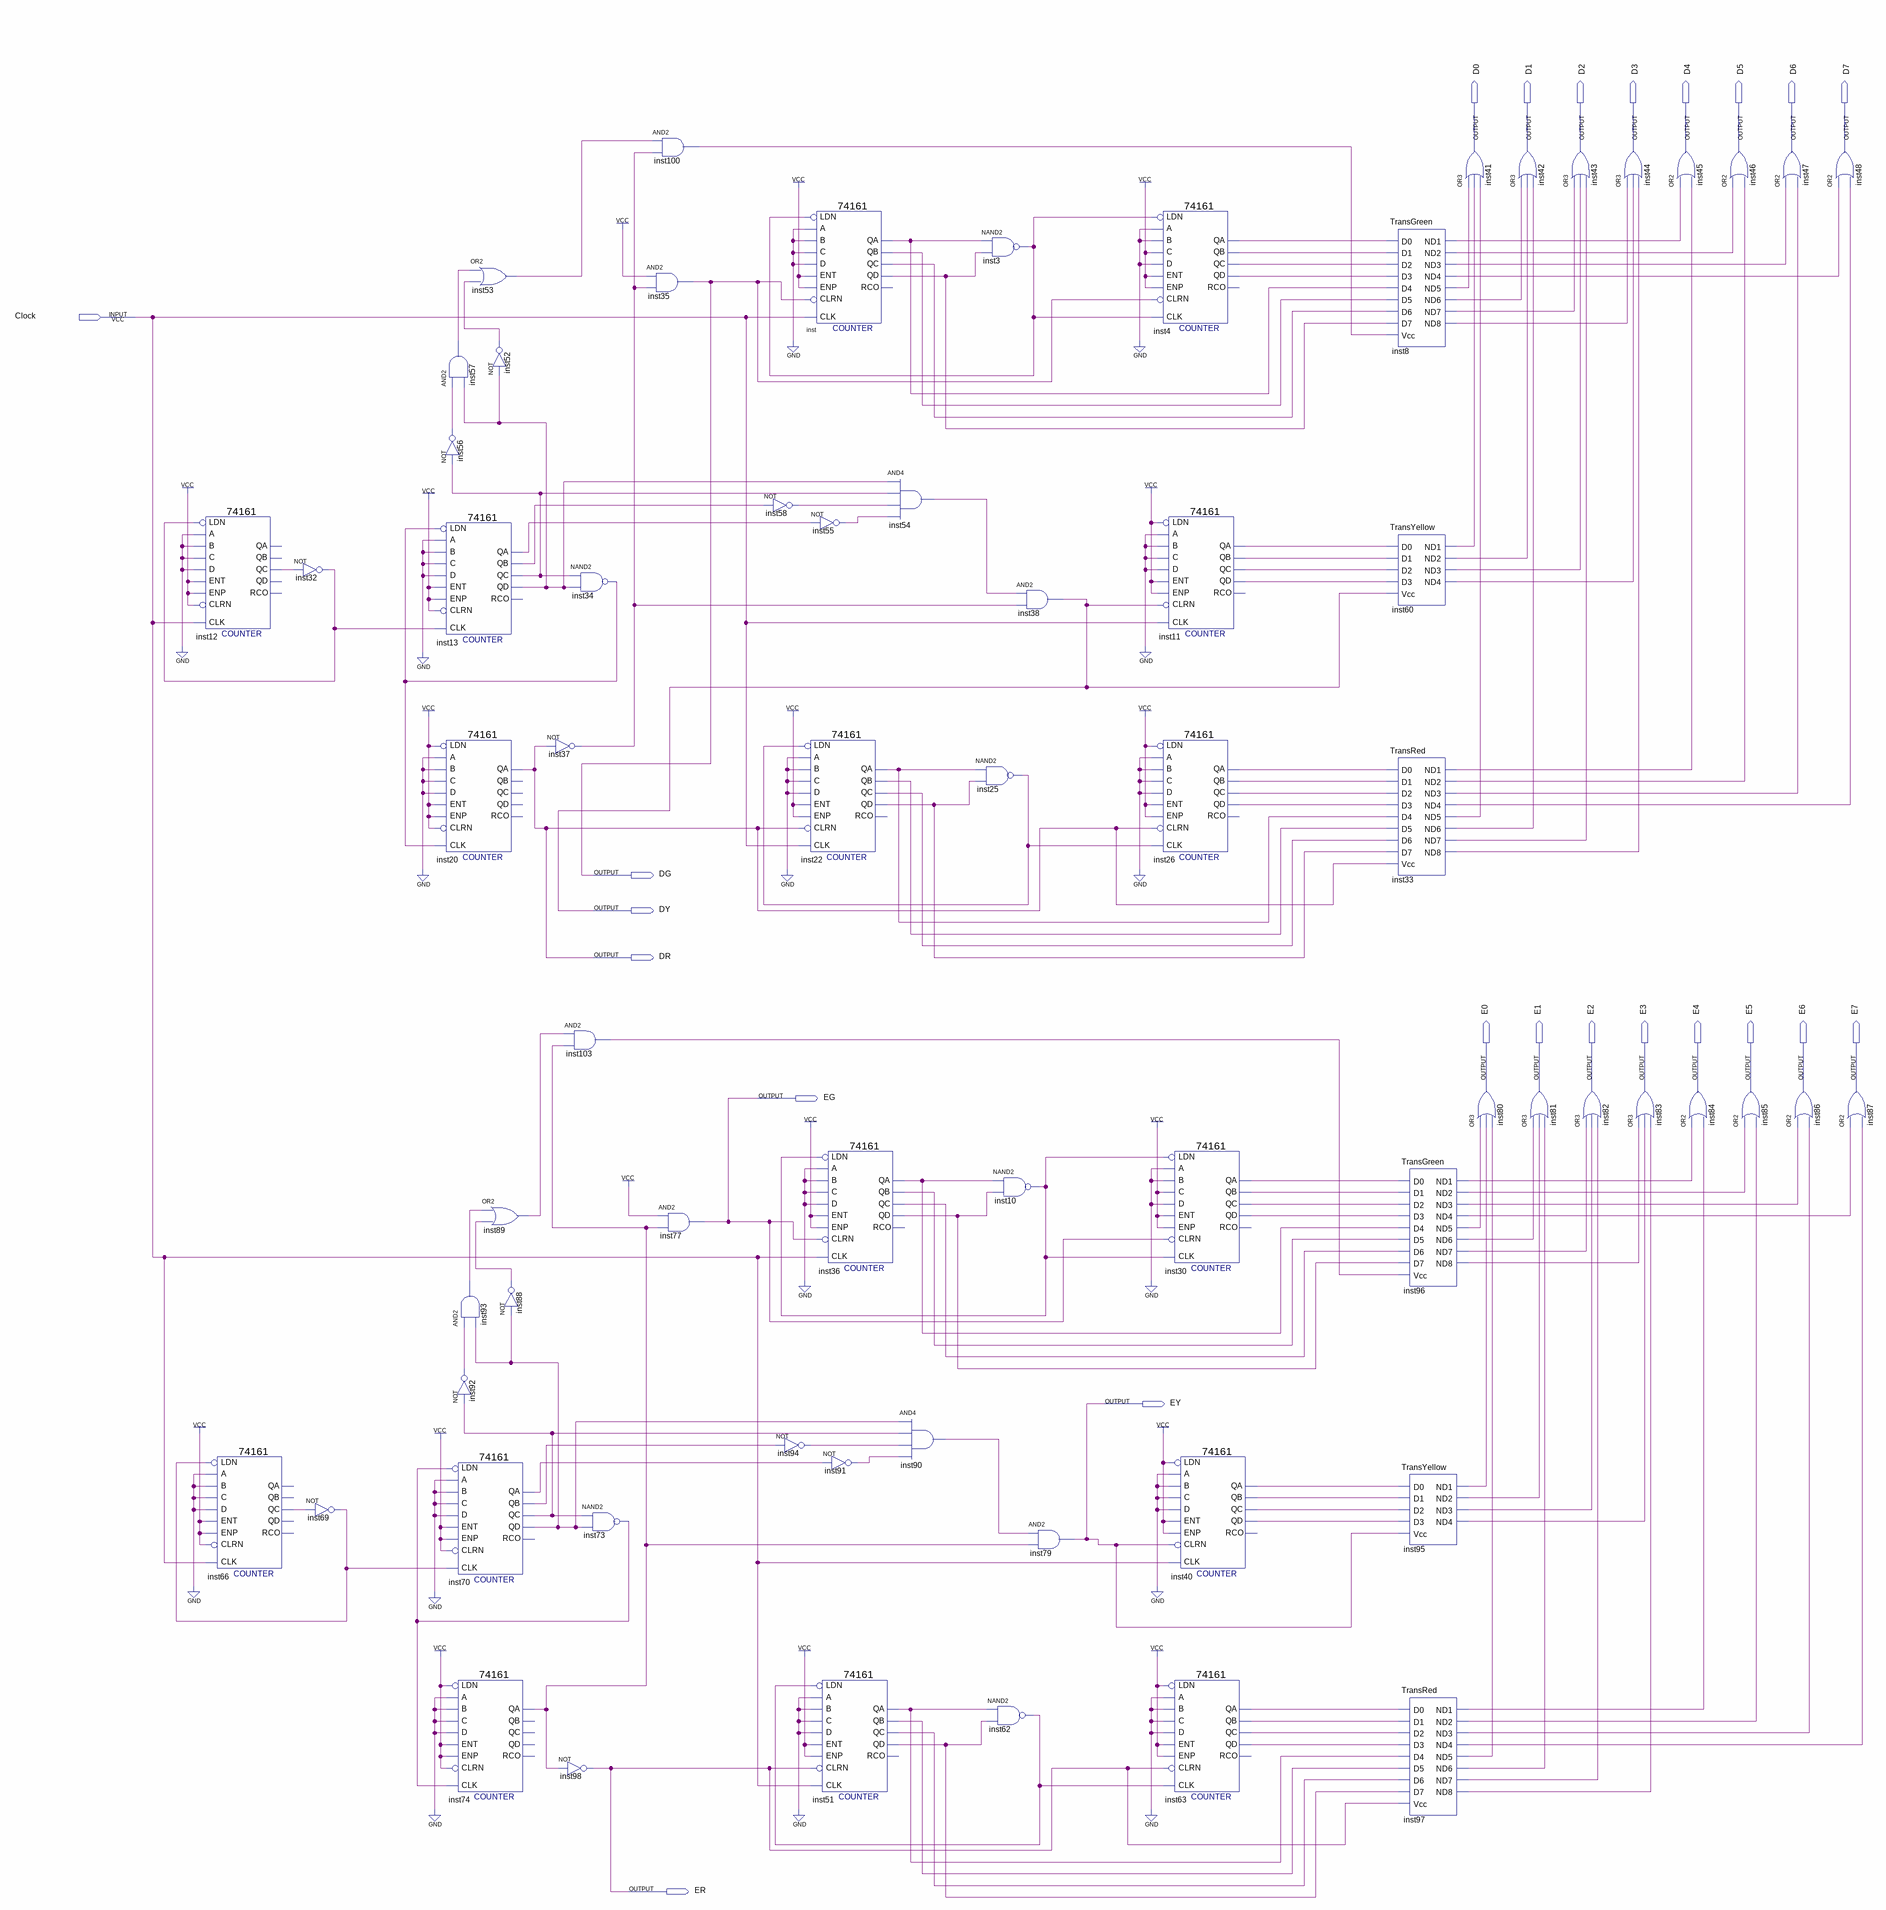
[diagram p0: schematic sheet]
// Quartus schematic Countdown.bdf as structural Verilog: 68 symbols, 23 pins
module Countdown (
  input  Clock,
  output D0,
  output D1,
  output D2,
  output D3,
  output D4,
  output D5,
  output D6,
  output D7,
  output DG,
  output DY,
  output DR,
  output E0,
  output E1,
  output E2,
  output E3,
  output E4,
  output E5,
  output E6,
  output E7,
  output EG,
  output EY,
  output ER
);

  wire inst3_out, inst4_qa, inst4_qb, inst4_qc, inst4_qd, inst8_nd1, inst8_nd2, inst8_nd3, inst8_nd4,
       inst8_nd5, inst8_nd6, inst8_nd7, inst8_nd8, inst10_out, inst11_qa, inst11_qb, inst11_qc, inst11_qd,
       inst12_qc, inst13_qa, inst13_qb, inst13_qc, inst13_qd, inst22_qa, inst22_qb, inst22_qc, inst22_qd,
       inst25_out, inst26_qa, inst26_qb, inst26_qc, inst26_qd, inst30_qa, inst30_qb, inst30_qc, inst30_qd,
       inst32_out, inst33_nd1, inst33_nd2, inst33_nd3, inst33_nd4, inst33_nd5, inst33_nd6, inst33_nd7,
       inst33_nd8, inst34_out, inst36_qa, inst36_qb, inst36_qc, inst36_qd, inst37_out, inst40_qa, inst40_qb,
       inst40_qc, inst40_qd, inst51_qa, inst51_qb, inst51_qc, inst51_qd, inst52_out, inst53_out, inst54_out,
       inst55_out, inst56_out, inst57_out, inst58_out, inst60_nd1, inst60_nd2, inst60_nd3, inst60_nd4,
       inst62_out, inst63_qa, inst63_qb, inst63_qc, inst63_qd, inst66_qc, inst69_out, inst70_qa, inst70_qb,
       inst70_qc, inst70_qd, inst73_out, inst74_qa, inst88_out, inst89_out, inst90_out, inst91_out,
       inst92_out, inst93_out, inst94_out, inst95_nd1, inst95_nd2, inst95_nd3, inst95_nd4, inst96_nd1,
       inst96_nd2, inst96_nd3, inst96_nd4, inst96_nd5, inst96_nd6, inst96_nd7, inst96_nd8, inst97_nd1,
       inst97_nd2, inst97_nd3, inst97_nd4, inst97_nd5, inst97_nd6, inst97_nd7, inst97_nd8, inst100_out,
       inst103_out, inst_qa, inst_qb, inst_qc, inst_qd;

  \74161  inst12 (
    .CLRN(1'b1), .CLK(Clock), .ENP(1'b1), .LDN(inst32_out), .A(1'b0), .D(1'b0), .ENT(1'b1), .B(1'b0),
    .C(1'b0), .QC(inst12_qc));  // open: QD, QB, QA, RCO
  \74161  inst66 (
    .CLRN(1'b1), .CLK(Clock), .ENP(1'b1), .LDN(inst69_out), .A(1'b0), .D(1'b0), .ENT(1'b1), .B(1'b0),
    .C(1'b0), .QC(inst66_qc));  // open: QD, QB, QA, RCO
  not inst32 (inst32_out, inst12_qc);
  not inst69 (inst69_out, inst66_qc);
  and inst57 (inst57_out, inst56_out, inst13_qd);
  not inst56 (inst56_out, inst13_qc);
  \74161  inst13 (
    .CLRN(1'b1), .CLK(inst32_out), .ENP(1'b1), .LDN(inst34_out), .A(1'b0), .D(1'b0), .ENT(1'b1), .B(1'b0),
    .C(1'b0), .QD(inst13_qd), .QC(inst13_qc), .QB(inst13_qb), .QA(inst13_qa));  // open: RCO
  \74161  inst20 (
    .CLRN(1'b1), .CLK(inst34_out), .ENP(1'b1), .LDN(1'b1), .A(1'b0), .D(1'b0), .ENT(1'b1), .B(1'b0),
    .C(1'b0), .QA(DR));  // open: QD, QC, QB, RCO
  \74161  inst70 (
    .CLRN(1'b1), .CLK(inst69_out), .ENP(1'b1), .LDN(inst73_out), .A(1'b0), .D(1'b0), .ENT(1'b1), .B(1'b0),
    .C(1'b0), .QD(inst70_qd), .QC(inst70_qc), .QB(inst70_qb), .QA(inst70_qa));  // open: RCO
  \74161  inst74 (
    .CLRN(1'b1), .CLK(inst73_out), .ENP(1'b1), .LDN(1'b1), .A(1'b0), .D(1'b0), .ENT(1'b1), .B(1'b0),
    .C(1'b0), .QA(inst74_qa));  // open: QD, QC, QB, RCO
  or inst53 (inst53_out, inst57_out, inst52_out);
  not inst52 (inst52_out, inst13_qd);
  or inst89 (inst89_out, inst93_out, inst88_out);
  and inst93 (inst93_out, inst92_out, inst70_qd);
  not inst92 (inst92_out, inst70_qc);
  not inst88 (inst88_out, inst70_qd);
  nand inst34 (inst34_out, inst13_qc, inst13_qd);
  not inst37 (inst37_out, DR);
  and inst103 (inst103_out, inst89_out, inst74_qa);
  nand inst73 (inst73_out, inst70_qc, inst70_qd);
  not inst98 (ER, inst74_qa);
  and inst100 (inst100_out, inst53_out, inst37_out);
  and inst35 (DG, 1'b1, inst37_out);
  and inst77 (EG, 1'b1, inst74_qa);
  not inst58 (inst58_out, inst13_qb);
  not inst94 (inst94_out, inst70_qb);
  \74161  inst (
    .CLRN(DG), .CLK(Clock), .ENP(1'b1), .LDN(inst3_out), .A(1'b0), .D(1'b0), .ENT(1'b1), .B(1'b0), .C(1'b0),
    .QD(inst_qd), .QC(inst_qc), .QB(inst_qb), .QA(inst_qa));  // open: RCO
  not inst55 (inst55_out, inst13_qa);
  \74161  inst22 (
    .CLRN(DR), .CLK(Clock), .ENP(1'b1), .LDN(inst25_out), .A(1'b0), .D(1'b0), .ENT(1'b1), .B(1'b0), .C(1'b0),
    .QD(inst22_qd), .QC(inst22_qc), .QB(inst22_qb), .QA(inst22_qa));  // open: RCO
  \74161  inst36 (
    .CLRN(EG), .CLK(Clock), .ENP(1'b1), .LDN(inst10_out), .A(1'b0), .D(1'b0), .ENT(1'b1), .B(1'b0), .C(1'b0),
    .QD(inst36_qd), .QC(inst36_qc), .QB(inst36_qb), .QA(inst36_qa));  // open: RCO
  not inst91 (inst91_out, inst70_qa);
  \74161  inst51 (
    .CLRN(ER), .CLK(Clock), .ENP(1'b1), .LDN(inst62_out), .A(1'b0), .D(1'b0), .ENT(1'b1), .B(1'b0), .C(1'b0),
    .QD(inst51_qd), .QC(inst51_qc), .QB(inst51_qb), .QA(inst51_qa));  // open: RCO
  and inst54 (inst54_out, inst13_qd, inst13_qc, inst58_out, inst55_out);
  and inst90 (inst90_out, inst70_qd, inst70_qc, inst94_out, inst91_out);
  nand inst3 (inst3_out, inst_qa, inst_qd);
  nand inst25 (inst25_out, inst22_qa, inst22_qd);
  nand inst10 (inst10_out, inst36_qa, inst36_qd);
  nand inst62 (inst62_out, inst51_qa, inst51_qd);
  and inst38 (DY, inst54_out, inst37_out);
  and inst79 (EY, inst90_out, inst74_qa);
  \74161  inst4 (
    .CLRN(DG), .CLK(inst3_out), .ENP(1'b1), .LDN(inst3_out), .A(1'b0), .D(1'b0), .ENT(1'b1), .B(1'b0),
    .C(1'b1), .QD(inst4_qd), .QC(inst4_qc), .QB(inst4_qb), .QA(inst4_qa));  // open: RCO
  \74161  inst26 (
    .CLRN(DR), .CLK(inst25_out), .ENP(1'b1), .LDN(1'b1), .A(1'b0), .D(1'b0), .ENT(1'b1), .B(1'b0), .C(1'b0),
    .QD(inst26_qd), .QC(inst26_qc), .QB(inst26_qb), .QA(inst26_qa));  // open: RCO
  \74161  inst11 (
    .CLRN(DY), .CLK(Clock), .ENP(1'b1), .LDN(1'b1), .A(1'b0), .D(1'b0), .ENT(1'b1), .B(1'b0), .C(1'b0),
    .QD(inst11_qd), .QC(inst11_qc), .QB(inst11_qb), .QA(inst11_qa));  // open: RCO
  \74161  inst30 (
    .CLRN(EG), .CLK(inst10_out), .ENP(1'b1), .LDN(inst10_out), .A(1'b0), .D(1'b0), .ENT(1'b1), .B(1'b0),
    .C(1'b1), .QD(inst30_qd), .QC(inst30_qc), .QB(inst30_qb), .QA(inst30_qa));  // open: RCO
  \74161  inst40 (
    .CLRN(EY), .CLK(Clock), .ENP(1'b1), .LDN(1'b1), .A(1'b0), .D(1'b0), .ENT(1'b1), .B(1'b0), .C(1'b0),
    .QD(inst40_qd), .QC(inst40_qc), .QB(inst40_qb), .QA(inst40_qa));  // open: RCO
  \74161  inst63 (
    .CLRN(ER), .CLK(inst62_out), .ENP(1'b1), .LDN(1'b1), .A(1'b0), .D(1'b0), .ENT(1'b1), .B(1'b0), .C(1'b0),
    .QD(inst63_qd), .QC(inst63_qc), .QB(inst63_qb), .QA(inst63_qa));  // open: RCO
  TransGreen inst8 (
    .D0(inst4_qa), .D1(inst4_qb), .D2(inst4_qc), .D3(inst4_qd), .D4(inst_qa), .D5(inst_qb), .D6(inst_qc),
    .D7(inst_qd), .Vcc(inst100_out), .ND1(inst8_nd1), .ND2(inst8_nd2), .ND3(inst8_nd3), .ND4(inst8_nd4),
    .ND5(inst8_nd5), .ND6(inst8_nd6), .ND7(inst8_nd7), .ND8(inst8_nd8));
  TransYellow inst60 (
    .D0(inst11_qa), .D1(inst11_qb), .D2(inst11_qc), .D3(inst11_qd), .Vcc(DY), .ND1(inst60_nd1),
    .ND2(inst60_nd2), .ND3(inst60_nd3), .ND4(inst60_nd4));
  TransRed inst33 (
    .D0(inst26_qa), .D1(inst26_qb), .D2(inst26_qc), .D3(inst26_qd), .D4(inst22_qa), .D5(inst22_qb),
    .D6(inst22_qc), .D7(inst22_qd), .Vcc(DR), .ND1(inst33_nd1), .ND2(inst33_nd2), .ND3(inst33_nd3),
    .ND4(inst33_nd4), .ND5(inst33_nd5), .ND6(inst33_nd6), .ND7(inst33_nd7), .ND8(inst33_nd8));
  TransGreen inst96 (
    .D0(inst30_qa), .D1(inst30_qb), .D2(inst30_qc), .D3(inst30_qd), .D4(inst36_qa), .D5(inst36_qb),
    .D6(inst36_qc), .D7(inst36_qd), .Vcc(inst103_out), .ND1(inst96_nd1), .ND2(inst96_nd2), .ND3(inst96_nd3),
    .ND4(inst96_nd4), .ND5(inst96_nd5), .ND6(inst96_nd6), .ND7(inst96_nd7), .ND8(inst96_nd8));
  TransYellow inst95 (
    .D0(inst40_qa), .D1(inst40_qb), .D2(inst40_qc), .D3(inst40_qd), .Vcc(EY), .ND1(inst95_nd1),
    .ND2(inst95_nd2), .ND3(inst95_nd3), .ND4(inst95_nd4));
  TransRed inst97 (
    .D0(inst63_qa), .D1(inst63_qb), .D2(inst63_qc), .D3(inst63_qd), .D4(inst51_qa), .D5(inst51_qb),
    .D6(inst51_qc), .D7(inst51_qd), .Vcc(ER), .ND1(inst97_nd1), .ND2(inst97_nd2), .ND3(inst97_nd3),
    .ND4(inst97_nd4), .ND5(inst97_nd5), .ND6(inst97_nd6), .ND7(inst97_nd7), .ND8(inst97_nd8));
  or inst41 (D0, inst8_nd5, inst60_nd1, inst33_nd5);
  or inst80 (E0, inst96_nd5, inst95_nd1, inst97_nd5);
  or inst42 (D1, inst8_nd6, inst60_nd2, inst33_nd6);
  or inst81 (E1, inst96_nd6, inst95_nd2, inst97_nd6);
  or inst43 (D2, inst8_nd7, inst60_nd3, inst33_nd7);
  or inst82 (E2, inst96_nd7, inst95_nd3, inst97_nd7);
  or inst44 (D3, inst8_nd8, inst60_nd4, inst33_nd8);
  or inst45 (D4, inst8_nd1, inst33_nd1);
  or inst83 (E3, inst96_nd8, inst95_nd4, inst97_nd8);
  or inst84 (E4, inst96_nd1, inst97_nd1);
  or inst46 (D5, inst8_nd2, inst33_nd2);
  or inst85 (E5, inst96_nd2, inst97_nd2);
  or inst47 (D6, inst8_nd3, inst33_nd3);
  or inst86 (E6, inst96_nd3, inst97_nd3);
  or inst48 (D7, inst8_nd4, inst33_nd4);
  or inst87 (E7, inst96_nd4, inst97_nd4);
endmodule
